# Altium schematic sheet CANLED.SchDoc
size A; SheetNumber: 1; SheetTotal: 1
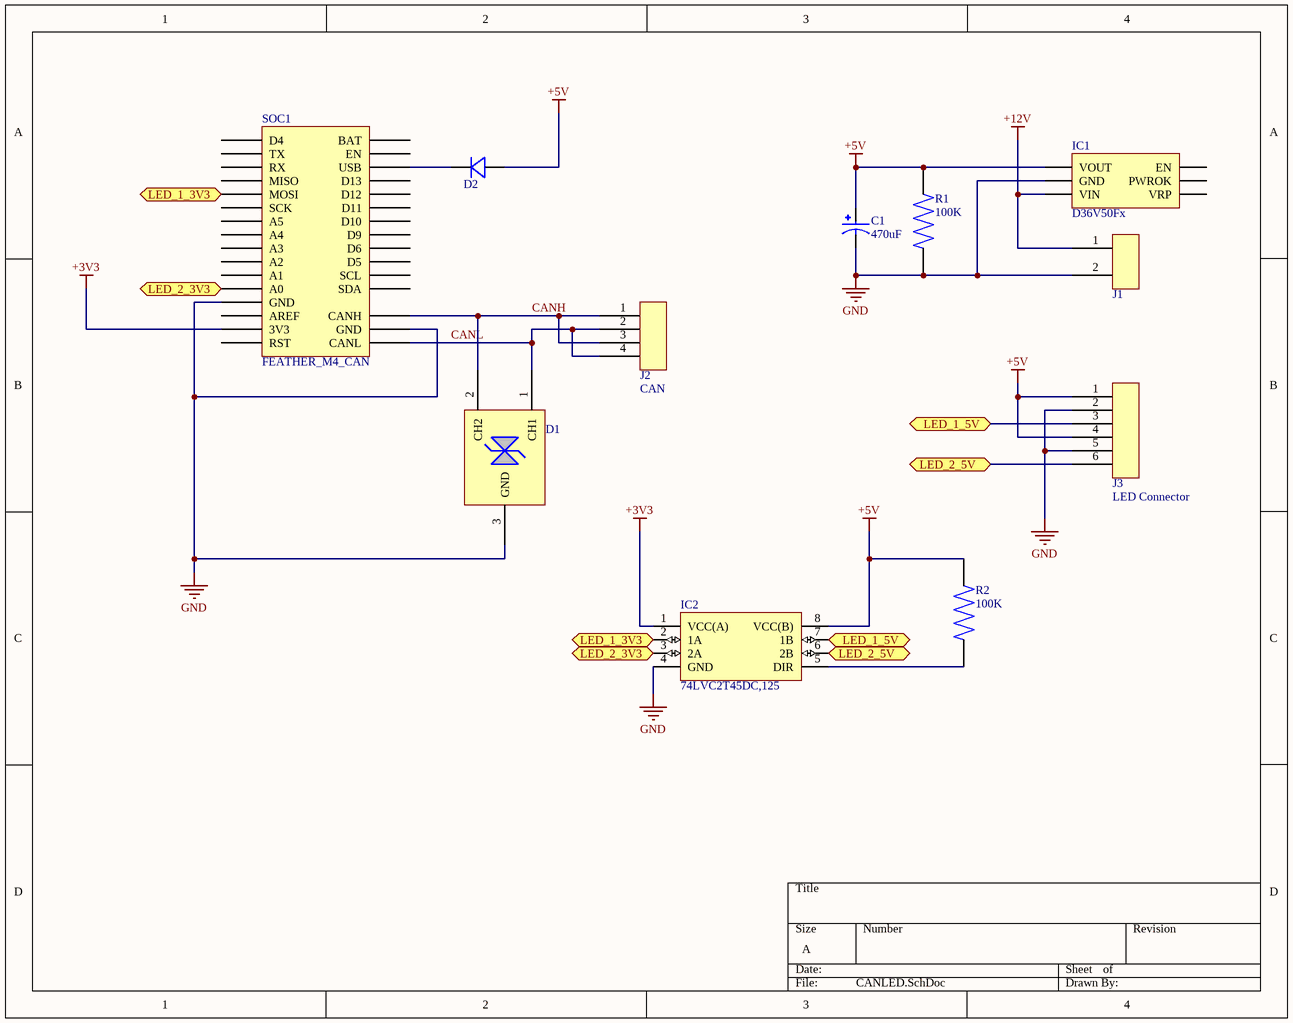
[diagram p0: CANLED.SchDoc]

## Parts
C1  470uF  [CAP_EEE0JA471UAP]
D1  DESD2CAN2SOQ-7  [SOT23-3]  (value not drawn)
D2  LSM115JE3/TR13  [DO-214BA_MCH]  (value not drawn)
IC1  D36V50Fx  [D36V50Fx]
IC2  74LVC2T45DC,125  [SOP50P310X100-8N]
J1  Power  [1-2834011-2]  (value not drawn)
J2  CAN  [1885200000]
J3  LED Connector  [1-2834011-6]
R1  100K  [RES_ERJ6ENF1003V]
R2  100K  [RES_ERJ6ENF1003V]
SOC1  FEATHER_M4_CAN  [FEATHER_M4_EXPRESS_CAN]

## Ports
LED_1_3V3 (bidir), LED_1_5V (bidir), LED_2_3V3 (bidir), LED_2_5V (bidir)

## Nets
+3V3: IC2.1(VCC(A)) SOC1.P1_15(3V3)
+5V: C1.1 D2.2 IC1.1(VOUT) IC2.8(VCC(B)) J3.1 J3.4 R1.2 R2.2
+12V: IC1.3(VIN) J1.1
GND: C1.2 D1.3(GND) IC1.2(GND) IC2.4(GND) J1.2 J3.2 J3.5 R1.1 SOC1.P1_13(GND) SOC1.P3_2(GND)
CANH: D1.2(CH2) J2.1 J2.3 SOC1.P3_1(CANH)
CANL: D1.1(CH1) J2.2 J2.4 SOC1.P3_3(CANL)
LED_1_3V3: IC2.2(1A) SOC1.P1_5(MOSI) ; port LED_1_3V3
LED_1_5V: IC2.7(1B) J3.3 ; port LED_1_5V
LED_2_3V3: IC2.3(2A) SOC1.P1_12(A0) ; port LED_2_3V3
LED_2_5V: IC2.6(2B) J3.6 ; port LED_2_5V
NetD2_1: D2.1 SOC1.P2_3(USB)
NetIC2_5: IC2.5(DIR) R2.1

Not connected (* = marked no-connect by the designer): IC1 4(VRP) 5(PWROK) 6(EN); SOC1 P1_1(D4) P1_2(TX) P1_3(RX) P1_4(MISO) P1_6(SCK) P1_7(A5) P1_8(A4) P1_9(A3) P1_10(A2) P1_11(A1) P1_14(AREF) P1_16(RST) P2_1(BAT) P2_2(EN) P2_4(D13) P2_5(D12) P2_6(D11) P2_7(D10) P2_8(D9) P2_9(D6) P2_10(D5) P2_11(SCL) P2_12(SDA)

## Library data of the parts
C1 = EEE0JA471UAP: 470ÂµF 6.3V Aluminum Electrolytic Capacitors Radial, Can - SMD 1000 Hrs @ 85Â°C; MF: Panasonic; MP: EEE-0JA471UAP; Value: *; SnapEDA_Link: https://www.snapeda.com/parts/EEE-0JA471UAP/Panasonic/view-part/2352035/?ref=snap; Check_prices: https://www.snapeda.com/parts/EEE-0JA471UAP/Panasonic/view-part/2352035/?ref=eda; Purchase-URL: https://pricing.snapeda.com/search/part/EEE-0JA471UAP/?ref=eda; Price: None; Availability: In Stock; Package: RADIAL-2 Panasonic
D1 = DESD2CAN2SOQ-7: ESD Suppressor Diode TVS Bi-Dir 24V Automotive 3-Pin SOT-23 T/R; Manufacturer: Diodes; Number of Bidirectional Channels: 2; Min Breakdown Voltage: 25.4V; Clamping Voltage: 41V; Peak Pulse Power: 230W; Power Line Protection: No; Peak Pulse Current: 5A; Supplier 1: Digi-Key; Manufacturer Part Number: DESD2CAN2SOQ-7; RoHS: Yes; Category: TVS Diodes; Stock 1: 91038; Pricing 1: 1=0.47000, 10=0.38300, 100=0.26050, 500=0.19536, 1000=0.14652 (USD); Mount: Surface Mount; Case/Package: TO-236-3; Min Operating Temperature: -65°C; Max Operating Temperature: 150°C; Packaging: Tape and Reel; Reverse Standoff Voltage: 24V; Resistor Type: Zener; ComponentLink1URL: http://www.farnell.com/datasheets/2814365.pdf?src-supplier=Farnell; ComponentLink1Description: http://www.farnell.com/datasheets/2814365.pdf?src-supplier=Farnell; ComponentLink2URL: http://www.mouser.com/ds/2/115/DESD2CAN2SOQ-520157.pdf?src-supplier=Mouser; ComponentLink2Description: http://www.mouser.com/ds/2/115/DESD2CAN2SOQ-520157.pdf?src-supplier=Mouser; ComponentLink3URL: https://www.diodes.com/assets/Datasheets/DESD2CAN2SOQ.pdf?src-supplier=Digi-Key; ComponentLink3Description: https://www.diodes.com/assets/Datasheets/DESD2CAN2SOQ.pdf?src-supplier=Digi-Key; ComponentLink4URL: http://www.farnell.com/datasheets/2814365.pdf?src-supplier=Element14; ComponentLink4Description: http://www.farnell.com/datasheets/2814365.pdf?src-supplier=Element14; ComponentLink5URL: http://www.farnell.com/datasheets/2814365.pdf?src-supplier=Newark; ComponentLink5Description: http://www.farnell.com/datasheets/2814365.pdf?src-supplier=Newark; Supplier Part Number 1: DESD2CAN2SOQ-7DICT-ND
D2 = LSM115JE3/TR13: No Description Available; Mfr_Name: Microchip; Type: DEV; Copyright: Copyright (C) 2022 Ultra Librarian. All rights reserved.; Manufacturer_Part_Number: LSM115JE3/TR13; Digi-Key_Part_Number_1: LSM115JE3/TR13TR-ND; Digi-Key_Part_Number_2: LSM115JE3/TR13CT-ND; Digi-Key_Part_Number_3: LSM115JE3/TR13DKR-ND; RefDes: RefDes
IC2 = 74LVC2T45DC,125: Voltage Level Translator Bidirectional 1 Circuit 2 Channel 420Mbps 8-VSSOP; MF: Nexperia USA; MP: 74LVC2T45DC,125; Value: *; Availability: Good; Package: VSSOP8-8 Nexperia USA Inc.; Check_prices: https://www.snapeda.com/parts/74LVC2T45DC,125/Nexperia/view-part/287401/?ref=eda; Price: None; SnapEDA_Link: https://www.snapeda.com/parts/74LVC2T45DC,125/Nexperia/view-part/287401/?ref=snap; Purchase-URL: https://pricing.snapeda.com/search/part/74LVC2T45DC,125/?ref=eda
J1 = 1-2834011-2: Conn PC Terminal Block RCP 2 POS 3.5mm Solder ST Thru-Hole 6A/Contact Box/Carton; Manufacturer: TE Connectivity; Current Rating: 6A; Voltage Rating: 300V; Connector Type: Receptacle,Connector; Number of Positions: 2; Sealable: No (Without); Wire/Cable Gauge: 14AWG; Approvals: UL; Supplier 1: Digi-Key; Manufacturer Part Number: 1-2834011-2; RoHS: Yes; Category: Terminal Blocks; Stock 1: 40747; Pricing 1: 1=0.68000, 10=0.42600, 25=0.36440, 50=0.32780, 100=0.32090, 250=0.27308, 500=0.25942, 1000=0.23212, 5000=0.18206 (USD); Number of Pins: 2; Contact Plating: Tin,Lead; Packaging: Box; Termination: Through Hole; Contact Current Rating: 6A; REACH SVHC: Unknown; Lead Free: Lead Free; RoHS Compliant: Yes; ComponentLink1URL: http://www.te.com/commerce/DocumentDelivery/DDEController?Action=srchrtrv&DocNm=1-1773872-7_ModularScrewlessTerminalBloc&DocType=DS&DocLang=English&src-supplier=Digi-Key; ComponentLink1Description: http://www.te.com/commerce/DocumentDelivery/DDEController?Action=srchrtrv&DocNm=1-1773872-7_ModularScrewlessTerminalBloc&DocType=DS&DocLang=English&src-supplier=Digi-Key; ComponentLink2URL: http://www.farnell.com/datasheets/2057753.pdf?src-supplier=Element14; ComponentLink2Description: http://www.farnell.com/datasheets/2057753.pdf?src-supplier=Element14; ComponentLink3URL: http://www.farnell.com/datasheets/2296738.pdf?src-supplier=Newark; ComponentLink3Description: http://www.farnell.com/datasheets/2296738.pdf?src-supplier=Newark; Supplier Part Number 1: A123848-ND
J2 = 1885200000
J3 = 1-2834011-6: Conn PC Terminal Block 6 POS 3.5mm Solder ST Thru-Hole 6A/Contact Box/Carton; Manufacturer: TE Connectivity; Connector Type: Receptacle,Connector; Sealable: No (Without); Contact Current Rating: 6A; Wire/Cable Gauge: 14AWG; Approvals: UL; Supplier 1: Digi-Key; Manufacturer Part Number: 1-2834011-6; RoHS: No; Category: Terminal Blocks; Stock 1: 4797; Pricing 1: 1=1.42000, 10=1.00100, 25=0.93320, 50=0.84700, 100=0.84320, 250=0.71200, 500=0.67454, 1000=0.59959, 5000=0.49966 (USD); Number of Pins: 6; Contact Plating: Tin,Lead; Packaging: Box; Termination: Through Hole; Lead Free: Lead Free; ComponentLink1URL: http://www.te.com/commerce/DocumentDelivery/DDEController?Action=srchrtrv&DocNm=2834011&DocType=Customer+Drawing&DocLang=English&src-supplier=Digi-Key; ComponentLink1Description: http://www.te.com/commerce/DocumentDelivery/DDEController?Action=srchrtrv&DocNm=2834011&DocType=Customer+Drawing&DocLang=English&src-supplier=Digi-Key; Supplier Part Number 1: A123851-ND
R1 R2 = ERJ6ENF1003V: Value: *; MP: ERJ6ENF1003V; Availability: Unavailable; Price: None; Package: None